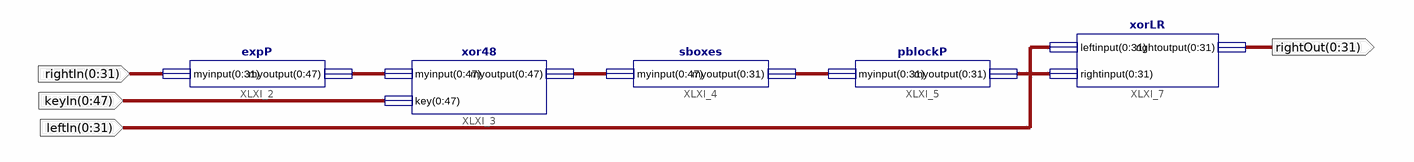
[diagram p0: schematic sheet 1]
// Xilinx ISE schematic Feistel.sch (spartan3e) as structural Verilog: 5 symbols, 4 ports
module Feistel (
  input  [0:31] rightIn,
  input  [0:47] keyIn,
  input  [0:31] leftIn,
  output [0:31] rightOut
);

  wire [31:0] XLXN_7, XLXN_9;
  wire [47:0] XLXN_4, XLXN_6;

  expP XLXI_2 (
    .myinput(rightIn),
    .myoutput({XLXN_4[0], XLXN_4[1], XLXN_4[2], XLXN_4[3], XLXN_4[4], XLXN_4[5], XLXN_4[6], XLXN_4[7], XLXN_4[8], XLXN_4[9], XLXN_4[10], XLXN_4[11], XLXN_4[12], XLXN_4[13], XLXN_4[14], XLXN_4[15], XLXN_4[16], XLXN_4[17], XLXN_4[18], XLXN_4[19], XLXN_4[20], XLXN_4[21], XLXN_4[22], XLXN_4[23], XLXN_4[24], XLXN_4[25], XLXN_4[26], XLXN_4[27], XLXN_4[28], XLXN_4[29], XLXN_4[30], XLXN_4[31], XLXN_4[32], XLXN_4[33], XLXN_4[34], XLXN_4[35], XLXN_4[36], XLXN_4[37], XLXN_4[38], XLXN_4[39], XLXN_4[40], XLXN_4[41], XLXN_4[42], XLXN_4[43], XLXN_4[44], XLXN_4[45], XLXN_4[46], XLXN_4[47]}));
  xor48 XLXI_3 (
    .myinput({XLXN_4[0], XLXN_4[1], XLXN_4[2], XLXN_4[3], XLXN_4[4], XLXN_4[5], XLXN_4[6], XLXN_4[7], XLXN_4[8], XLXN_4[9], XLXN_4[10], XLXN_4[11], XLXN_4[12], XLXN_4[13], XLXN_4[14], XLXN_4[15], XLXN_4[16], XLXN_4[17], XLXN_4[18], XLXN_4[19], XLXN_4[20], XLXN_4[21], XLXN_4[22], XLXN_4[23], XLXN_4[24], XLXN_4[25], XLXN_4[26], XLXN_4[27], XLXN_4[28], XLXN_4[29], XLXN_4[30], XLXN_4[31], XLXN_4[32], XLXN_4[33], XLXN_4[34], XLXN_4[35], XLXN_4[36], XLXN_4[37], XLXN_4[38], XLXN_4[39], XLXN_4[40], XLXN_4[41], XLXN_4[42], XLXN_4[43], XLXN_4[44], XLXN_4[45], XLXN_4[46], XLXN_4[47]}),
    .key(keyIn),
    .myoutput({XLXN_6[0], XLXN_6[1], XLXN_6[2], XLXN_6[3], XLXN_6[4], XLXN_6[5], XLXN_6[6], XLXN_6[7], XLXN_6[8], XLXN_6[9], XLXN_6[10], XLXN_6[11], XLXN_6[12], XLXN_6[13], XLXN_6[14], XLXN_6[15], XLXN_6[16], XLXN_6[17], XLXN_6[18], XLXN_6[19], XLXN_6[20], XLXN_6[21], XLXN_6[22], XLXN_6[23], XLXN_6[24], XLXN_6[25], XLXN_6[26], XLXN_6[27], XLXN_6[28], XLXN_6[29], XLXN_6[30], XLXN_6[31], XLXN_6[32], XLXN_6[33], XLXN_6[34], XLXN_6[35], XLXN_6[36], XLXN_6[37], XLXN_6[38], XLXN_6[39], XLXN_6[40], XLXN_6[41], XLXN_6[42], XLXN_6[43], XLXN_6[44], XLXN_6[45], XLXN_6[46], XLXN_6[47]}));
  sboxes XLXI_4 (
    .myinput({XLXN_6[0], XLXN_6[1], XLXN_6[2], XLXN_6[3], XLXN_6[4], XLXN_6[5], XLXN_6[6], XLXN_6[7], XLXN_6[8], XLXN_6[9], XLXN_6[10], XLXN_6[11], XLXN_6[12], XLXN_6[13], XLXN_6[14], XLXN_6[15], XLXN_6[16], XLXN_6[17], XLXN_6[18], XLXN_6[19], XLXN_6[20], XLXN_6[21], XLXN_6[22], XLXN_6[23], XLXN_6[24], XLXN_6[25], XLXN_6[26], XLXN_6[27], XLXN_6[28], XLXN_6[29], XLXN_6[30], XLXN_6[31], XLXN_6[32], XLXN_6[33], XLXN_6[34], XLXN_6[35], XLXN_6[36], XLXN_6[37], XLXN_6[38], XLXN_6[39], XLXN_6[40], XLXN_6[41], XLXN_6[42], XLXN_6[43], XLXN_6[44], XLXN_6[45], XLXN_6[46], XLXN_6[47]}),
    .myoutput({XLXN_7[0], XLXN_7[1], XLXN_7[2], XLXN_7[3], XLXN_7[4], XLXN_7[5], XLXN_7[6], XLXN_7[7], XLXN_7[8], XLXN_7[9], XLXN_7[10], XLXN_7[11], XLXN_7[12], XLXN_7[13], XLXN_7[14], XLXN_7[15], XLXN_7[16], XLXN_7[17], XLXN_7[18], XLXN_7[19], XLXN_7[20], XLXN_7[21], XLXN_7[22], XLXN_7[23], XLXN_7[24], XLXN_7[25], XLXN_7[26], XLXN_7[27], XLXN_7[28], XLXN_7[29], XLXN_7[30], XLXN_7[31]}));
  pblockP XLXI_5 (
    .myinput({XLXN_7[0], XLXN_7[1], XLXN_7[2], XLXN_7[3], XLXN_7[4], XLXN_7[5], XLXN_7[6], XLXN_7[7], XLXN_7[8], XLXN_7[9], XLXN_7[10], XLXN_7[11], XLXN_7[12], XLXN_7[13], XLXN_7[14], XLXN_7[15], XLXN_7[16], XLXN_7[17], XLXN_7[18], XLXN_7[19], XLXN_7[20], XLXN_7[21], XLXN_7[22], XLXN_7[23], XLXN_7[24], XLXN_7[25], XLXN_7[26], XLXN_7[27], XLXN_7[28], XLXN_7[29], XLXN_7[30], XLXN_7[31]}),
    .myoutput({XLXN_9[0], XLXN_9[1], XLXN_9[2], XLXN_9[3], XLXN_9[4], XLXN_9[5], XLXN_9[6], XLXN_9[7], XLXN_9[8], XLXN_9[9], XLXN_9[10], XLXN_9[11], XLXN_9[12], XLXN_9[13], XLXN_9[14], XLXN_9[15], XLXN_9[16], XLXN_9[17], XLXN_9[18], XLXN_9[19], XLXN_9[20], XLXN_9[21], XLXN_9[22], XLXN_9[23], XLXN_9[24], XLXN_9[25], XLXN_9[26], XLXN_9[27], XLXN_9[28], XLXN_9[29], XLXN_9[30], XLXN_9[31]}));
  xorLR XLXI_7 (
    .leftinput(leftIn),
    .rightinput({XLXN_9[0], XLXN_9[1], XLXN_9[2], XLXN_9[3], XLXN_9[4], XLXN_9[5], XLXN_9[6], XLXN_9[7], XLXN_9[8], XLXN_9[9], XLXN_9[10], XLXN_9[11], XLXN_9[12], XLXN_9[13], XLXN_9[14], XLXN_9[15], XLXN_9[16], XLXN_9[17], XLXN_9[18], XLXN_9[19], XLXN_9[20], XLXN_9[21], XLXN_9[22], XLXN_9[23], XLXN_9[24], XLXN_9[25], XLXN_9[26], XLXN_9[27], XLXN_9[28], XLXN_9[29], XLXN_9[30], XLXN_9[31]}),
    .rightoutput(rightOut));
endmodule
